# Altium project Heart-by-LED.PrjPCB
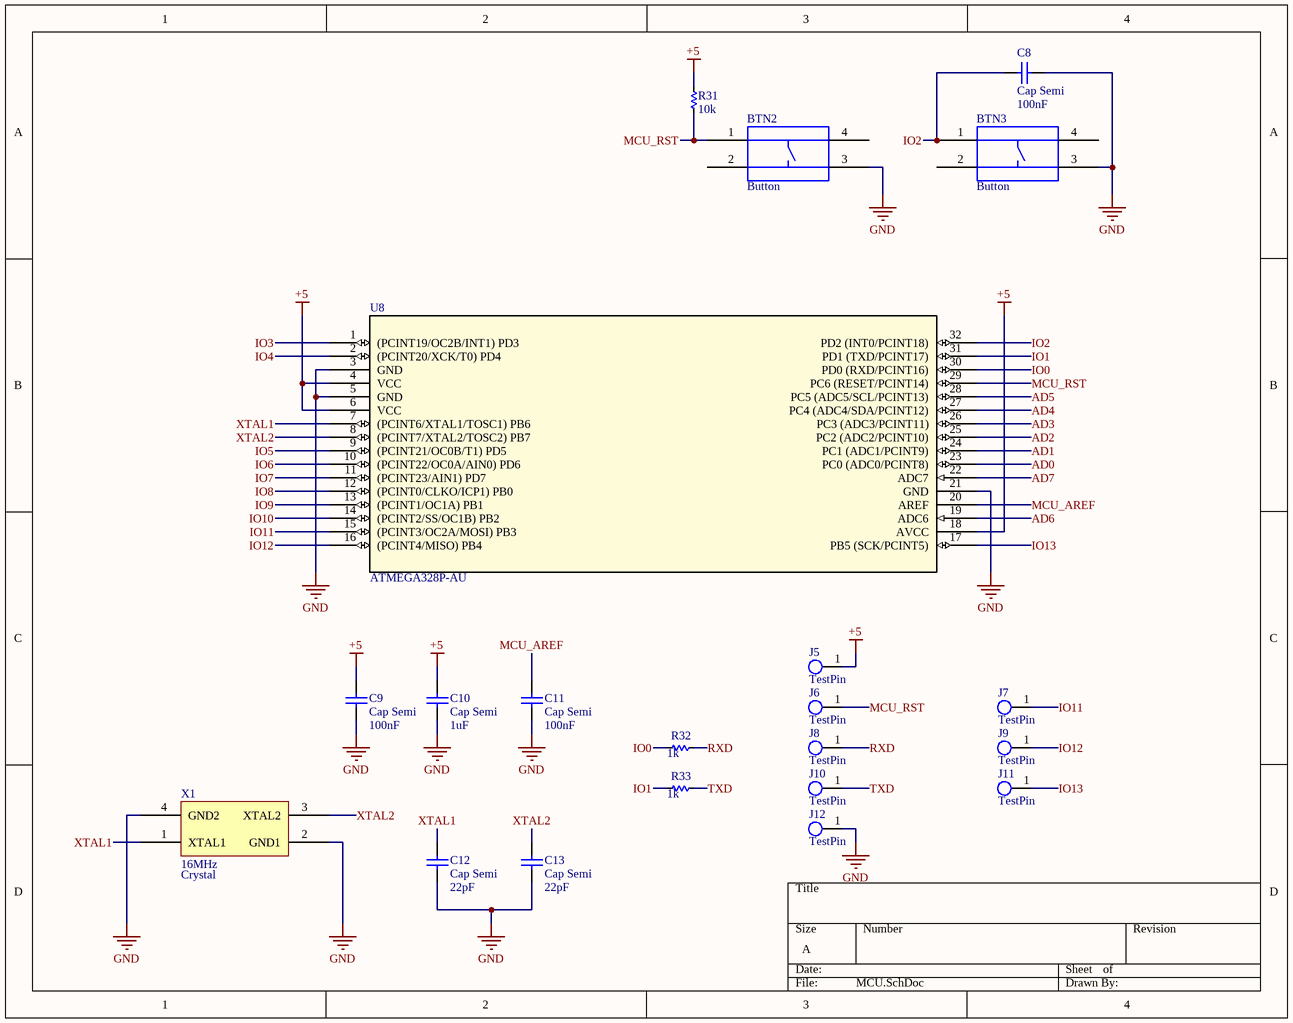
[diagram p0: MCU.SchDoc]
4 sheets, 117 parts. Net scope: global (net labels, ports and power ports of the same name join across sheets).
Board file: Heart-by-LED.PcbDoc
Sheets:
  MCU.SchDoc
  Power.SchDoc
  WS2812B.SchDoc
  LEDs.SchDoc

## Sheet MCU.SchDoc
size A

### Parts
BTN2  Button  [TactileButton_4x4]
BTN3  Button  [TactileButton_4x4]
C8  Cap Semi  value 100nF  [1608[0603]]
C9  Cap Semi  value 100nF  [1608[0603]]
C10  Cap Semi  value 1uF  [1608[0603]]
C11  Cap Semi  value 100nF  [1608[0603]]
C12  Cap Semi  value 22pF  [1608[0603]]
C13  Cap Semi  value 22pF  [1608[0603]]
J5  TestPin  [TestPin_1mm]
J6  TestPin  [TestPin_1mm]
J7  TestPin  [TestPin_1mm]
J8  TestPin  [TestPin_1mm]
J9  TestPin  [TestPin_1mm]
J10  TestPin  [TestPin_1mm]
J11  TestPin  [TestPin_1mm]
J12  TestPin  [TestPin_1mm]
R31  value 10k  [RES-SMD-0603]  (hidden comment: Res)
R32  value 1k  [RES-SMD-0603]  (hidden comment: Res)
R33  value 1k  [RES-SMD-0603]  (hidden comment: Res)
U8  ATMEGA328P-AU  [32A_ATM]
X1  Crystal  [SMD-3225-4P]

### Nets
+5: C9.2 C10.2 J5.1 R31.1 U8.4(VCC) U8.6(VCC) U8.18(AVCC)  [project net LED_DIN_5]
GND: BTN2.3(Pin3) BTN3.3(Pin3) C8.1 C9.1 C10.1 C11.1 C12.1 C13.1 J12.1 U8.3(GND) U8.5(GND) U8.21(GND) X1.2(GND1) X1.4(GND2)
AD0: U8.23(PC0_(ADC0/PCINT8))
AD1: U8.24(PC1_(ADC1/PCINT9))
AD2: U8.25(PC2_(ADC2/PCINT10))
AD3: U8.26(PC3_(ADC3/PCINT11))
AD4: U8.27(PC4_(ADC4/SDA/PCINT12))
AD5: U8.28(PC5_(ADC5/SCL/PCINT13))
AD6: U8.19(ADC6)
AD7: U8.22(ADC7)
IO0: R32.2 U8.30(PD0_(RXD/PCINT16))
IO1: R33.2 U8.31(PD1_(TXD/PCINT17))
IO2: BTN3.1(Pin1) C8.2 U8.32(PD2_(INT0/PCINT18))
IO3: U8.1((PCINT19/OC2B/INT1)_PD3)
IO4: U8.2((PCINT20/XCK/T0)_PD4)
IO5: U8.9((PCINT21/OC0B/T1)_PD5)
IO6: U8.10((PCINT22/OC0A/AIN0)_PD6)
IO7: U8.11((PCINT23/AIN1)_PD7)
IO8: U8.12((PCINT0/CLKO/ICP1)_PB0)
IO9: U8.13((PCINT1/OC1A)_PB1)
IO10: U8.14((PCINT2/SS/OC1B)_PB2)
IO11: J7.1 U8.15((PCINT3/OC2A/MOSI)_PB3)
IO12: J9.1 U8.16((PCINT4/MISO)_PB4)
IO13: J11.1 U8.17(PB5_(SCK/PCINT5))
MCU_AREF: C11.2 U8.20(AREF)
MCU_RST: BTN2.1(Pin1) J6.1 R31.2 U8.29(PC6_(RESET/PCINT14))
RXD: J8.1 R32.1
TXD: J10.1 R33.1
XTAL1: C12.2 U8.7((PCINT6/XTAL1/TOSC1)_PB6) X1.1(XTAL1)
XTAL2: C13.2 U8.8((PCINT7/XTAL2/TOSC2)_PB7) X1.3(XTAL2)

Not connected (* = marked no-connect by the designer): BTN2 2(Pin2) 4(Pin4); BTN3 2(Pin2) 4(Pin4)

### Library data of the parts
BTN2 BTN3 = Tactile_4x4
C8-C13 = Cap Semi: Capacitor (Semiconductor SIM Model); Published: 8-Jun-2000; LatestRevisionDate: 29-May-2009; LatestRevisionNote: IPC-7351 Footprint Added.; PackageReference: C1206; Publisher: Altium Limited; PackageDescription: Chip Capacitor
J5-J12 = TestPin_1mm: Test conntact for pogo pins
R31-R33 = Res-SMD: Resistor; Manufacturer: Generic Components; Class: Passive; Published: 08/06/2000; Publisher: Altium Hobart Technology Centre
U8 = ATMEGA328P-AU: No Description Available; Built_By: EMA_UL_Team; Vendor: Atmel; SourceLibrary: Atmel_2011-04-02; Manufacturer_Part_Number: ATMEGA328P-AU; Copyright: Copyright (C) 2018 Accelerated Designs. All rights reserved; RefDes: RefDes; Type: DEV
X1 = Crystal 3225: 16MHz ±25ppm SMD3225-4P Oscillators ROHS; Value: 16MHz

## Sheet Power.SchDoc
size A
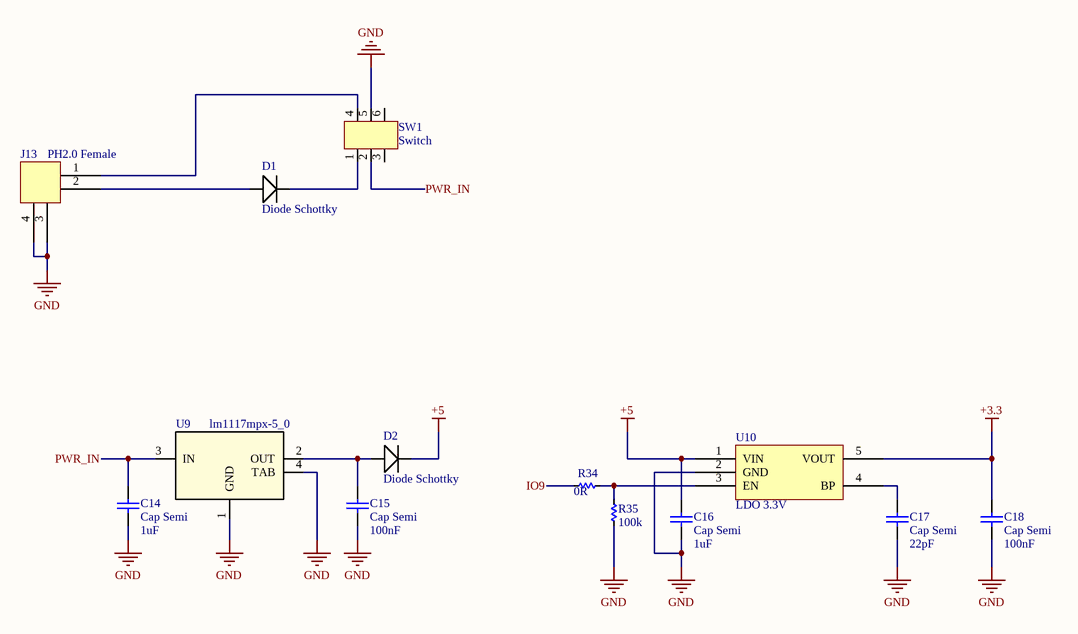
[diagram p1: Power.SchDoc]

### Parts
C14  Cap Semi  value 1uF  [1608[0603]]
C15  Cap Semi  value 100nF  [1608[0603]]
C16  Cap Semi  value 1uF  [1608[0603]]
C17  Cap Semi  value 22pF  [1608[0603]]
C18  Cap Semi  value 100nF  [1608[0603]]
D1  Diode Schottky  [DO-214AC]
D2  Diode Schottky  [DO-214AC]
J13  PH2.0 Female  [PH2.0 FEMALE]
R34  value 0R  [RES-SMD-0603]  (hidden comment: Res)
R35  value 100k  [RES-SMD-0603]  (hidden comment: Res)
SW1  Switch  [MSS-22D18]
U9  lm1117mpx-5_0  [LM1117]
U10  LDO 3.3V  [SOT-23-5]

### Nets
+3.3: C18.2 U10.5(VOUT)
+5: C16.2 D2.1(K) U10.1(VIN)  [project net LED_DIN_5]
GND: C14.1 C15.1 C16.1 C17.1 C18.1 J13.3(Pin_3) J13.4(Pin_4) R35.2 SW1.5(Pin_5) U9.1(GND) U9.4(TAB) U10.2(GND)
IO9: R34.2
PWR_IN: C14.2 SW1.2(Pin_2) U9.3(IN)
NetC15_2: C15.2 D2.2(A) U9.2(OUT)
NetC17_2: C17.2 U10.4(BP)
NetD1_1: D1.1(K) SW1.1(Pin_1)
NetD1_2: D1.2(A) J13.2(Pin_2)
NetJ13_1: J13.1(Pin_1) SW1.4(Pin_4)
NetR34_1: R34.1 R35.1 U10.3(EN)

Not connected (* = marked no-connect by the designer): SW1 3(Pin_3) 6(Pin_6)

### Library data of the parts
C14-C18 = Cap Semi: Capacitor (Semiconductor SIM Model); Published: 8-Jun-2000; LatestRevisionDate: 29-May-2009; LatestRevisionNote: IPC-7351 Footprint Added.; PackageReference: C1206; Publisher: Altium Limited; PackageDescription: Chip Capacitor
D1 D2 = SS54 SMA: Diode Shotky SS54 5A 40V; Value: SS54 SMA
J13 = PH2.0: 2 Header PH 0.079"(2.00mm) Male Pin SMD,P=2mm Wire To Board / Wire To Wire Connector ROHS
R34 R35 = Res-SMD: as R31 on sheet MCU; Published: 08/06/2000; Publisher: Altium Hobart Technology Centre
SW1 = MSS-22D18: Plugin,9.1x3.5mm Slide Switches ROHS
U9 = lm1117mpx-5_0: No Description Available; Vendor: Texas Instruments; Built_By: EMA_UL_Team; Manufacturer_Part_Number: lm1117mpx-5_0; Copyright: Copyright (C) 2018 Accelerated Designs. All rights reserved; RefDes: RefDes; Type: DEV; Value: Value
U10 = RT9193-33GB: 300mA Fixed 3.3V SOT-23-5 Linear Voltage Regulators (LDO) ROHS

## Sheet WS2812B.SchDoc
size A
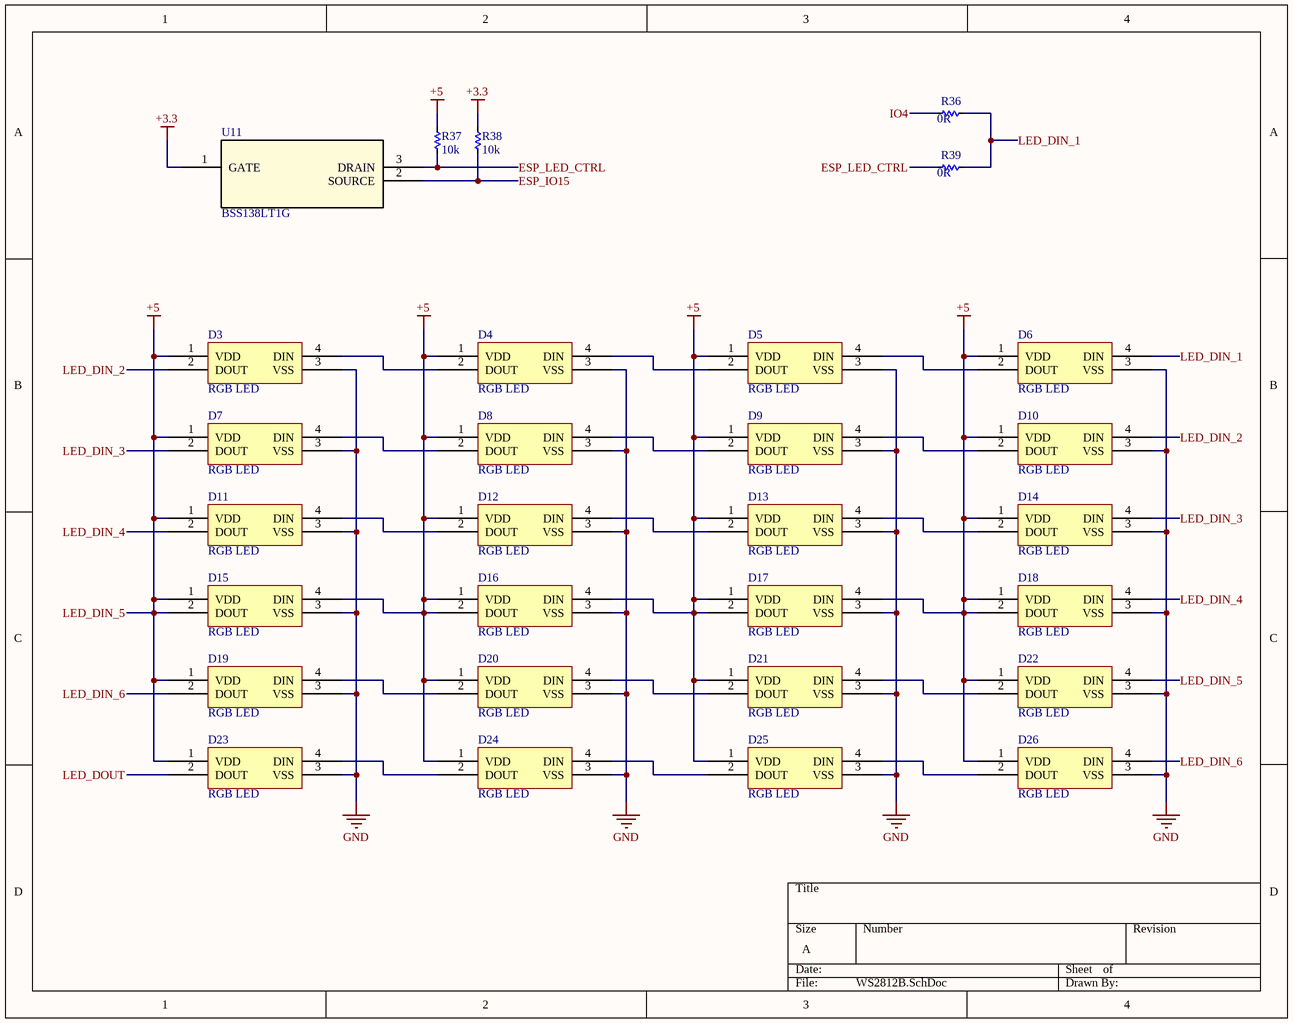
[diagram p2: WS2812B.SchDoc]

### Parts
D3  RGB LED  [WS2812B]
D4  RGB LED  [WS2812B]
D5  RGB LED  [WS2812B]
D6  RGB LED  [WS2812B]
D7  RGB LED  [WS2812B]
D8  RGB LED  [WS2812B]
D9  RGB LED  [WS2812B]
D10  RGB LED  [WS2812B]
D11  RGB LED  [WS2812B]
D12  RGB LED  [WS2812B]
D13  RGB LED  [WS2812B]
D14  RGB LED  [WS2812B]
D15  RGB LED  [WS2812B]
D16  RGB LED  [WS2812B]
D17  RGB LED  [WS2812B]
D18  RGB LED  [WS2812B]
D19  RGB LED  [WS2812B]
D20  RGB LED  [WS2812B]
D21  RGB LED  [WS2812B]
D22  RGB LED  [WS2812B]
D23  RGB LED  [WS2812B]
D24  RGB LED  [WS2812B]
D25  RGB LED  [WS2812B]
D26  RGB LED  [WS2812B]
R36  value 0R  [RES-SMD-0603]  (hidden comment: Res)
R37  value 10k  [RES-SMD-0603]  (hidden comment: Res)
R38  value 10k  [RES-SMD-0603]  (hidden comment: Res)
R39  value 0R  [RES-SMD-0603]  (hidden comment: Res)
U11  BSS138LT1G  [SOT23-3_ONS]

### Nets
+3.3: R38.1 U11.1(GATE)
GND: D3.3(VSS) D4.3(VSS) D5.3(VSS) D6.3(VSS) D7.3(VSS) D8.3(VSS) D9.3(VSS) D10.3(VSS) D11.3(VSS) D12.3(VSS) D13.3(VSS) D14.3(VSS) D15.3(VSS) D16.3(VSS) D17.3(VSS) D18.3(VSS) D19.3(VSS) D20.3(VSS) D21.3(VSS) D22.3(VSS) D23.3(VSS) D24.3(VSS) D25.3(VSS) D26.3(VSS)
LED_DIN_5: D3.1(VDD) D4.1(VDD) D5.1(VDD) D6.1(VDD) D7.1(VDD) D8.1(VDD) D9.1(VDD) D10.1(VDD) D11.1(VDD) D12.1(VDD) D13.1(VDD) D14.1(VDD) D15.1(VDD) D15.2(DOUT) D15.4(DIN) D16.1(VDD) D16.2(DOUT) D16.4(DIN) D17.1(VDD) D17.2(DOUT) D17.4(DIN) D18.1(VDD) D18.2(DOUT) D19.1(VDD) D20.1(VDD) D21.1(VDD) D22.1(VDD) D22.4(DIN) D23.1(VDD) D24.1(VDD) D25.1(VDD) D26.1(VDD) R37.1  [also labelled +5]
ESP_IO15: R38.2 U11.2(SOURCE)
ESP_LED_CTRL: R37.2 R39.2 U11.3(DRAIN)
IO4: R36.2
LED_DIN_1: D6.4(DIN) R36.1 R39.1
LED_DIN_2: D3.2(DOUT) D10.4(DIN)
LED_DIN_3: D7.2(DOUT) D14.4(DIN)
LED_DIN_4: D11.2(DOUT) D18.4(DIN)
LED_DIN_6: D19.2(DOUT) D26.4(DIN)
LED_DOUT: D23.2(DOUT)
NetD3_4: D3.4(DIN) D4.2(DOUT)
NetD4_4: D4.4(DIN) D5.2(DOUT)
NetD5_4: D5.4(DIN) D6.2(DOUT)
NetD7_4: D7.4(DIN) D8.2(DOUT)
NetD8_4: D8.4(DIN) D9.2(DOUT)
NetD9_4: D9.4(DIN) D10.2(DOUT)
NetD11_4: D11.4(DIN) D12.2(DOUT)
NetD12_4: D12.4(DIN) D13.2(DOUT)
NetD13_4: D13.4(DIN) D14.2(DOUT)
NetD19_4: D19.4(DIN) D20.2(DOUT)
NetD20_4: D20.4(DIN) D21.2(DOUT)
NetD21_4: D21.4(DIN) D22.2(DOUT)
NetD23_4: D23.4(DIN) D24.2(DOUT)
NetD24_4: D24.4(DIN) D25.2(DOUT)
NetD25_4: D25.4(DIN) D26.2(DOUT)

### Library data of the parts
D3-D26 = WS2812B: RGB 620~630nm Red, 515~530nm Green, 465~475nm Blue SMD,5x5mm Light Emitting Diodes (LED) ROHS; Manufacturer: Worldsemi; Value: WS2812B
R36-R39 = Res-SMD: as R31 on sheet MCU; Published: 08/06/2000; Publisher: Altium Hobart Technology Centre
U11 = BSS138LT1G: No Description Available; Vendor: ON Semiconductor; Built_By: EMA_Jessica; SourceLibrary: ON_Semiconductor_2019-12-30; Manufacturer_Part_Number: BSS138LT1G; Copyright: Copyright (C) 2018 Accelerated Designs. All rights reserved; RefDes: RefDes; Type: DEV

## Sheet LEDs.SchDoc
size A
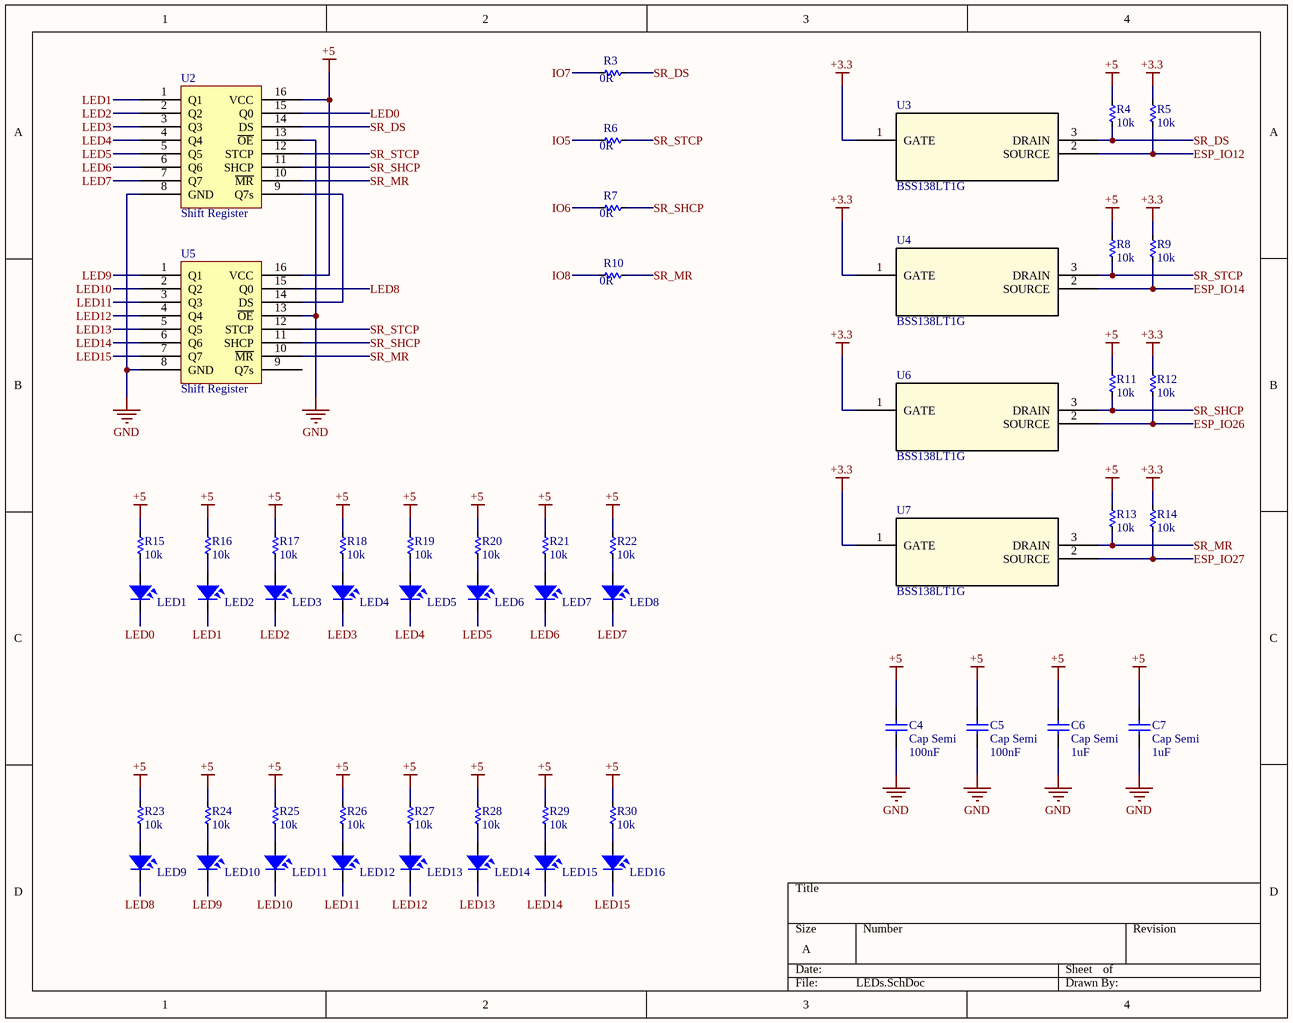
[diagram p3: LEDs.SchDoc]

### Parts
C4  Cap Semi  value 100nF  [1608[0603]]
C5  Cap Semi  value 100nF  [1608[0603]]
C6  Cap Semi  value 1uF  [1608[0603]]
C7  Cap Semi  value 1uF  [1608[0603]]
LED1  LED  [LED-0805-Red]  (value not drawn)
LED2  LED  [LED-0805-Red]  (value not drawn)
LED3  LED  [LED-0805-Red]  (value not drawn)
LED4  LED  [LED-0805-Red]  (value not drawn)
LED5  LED  [LED-0805-Red]  (value not drawn)
LED6  LED  [LED-0805-Red]  (value not drawn)
LED7  LED  [LED-0805-Red]  (value not drawn)
LED8  LED  [LED-0805-Red]  (value not drawn)
LED9  LED  [LED-0805-Red]  (value not drawn)
LED10  LED  [LED-0805-Red]  (value not drawn)
LED11  LED  [LED-0805-Red]  (value not drawn)
LED12  LED  [LED-0805-Red]  (value not drawn)
LED13  LED  [LED-0805-Red]  (value not drawn)
LED14  LED  [LED-0805-Red]  (value not drawn)
LED15  LED  [LED-0805-Red]  (value not drawn)
LED16  LED  [LED-0805-Red]  (value not drawn)
R3  value 0R  [RES-SMD-0603]  (hidden comment: Res)
R4  value 10k  [RES-SMD-0603]  (hidden comment: Res)
R5  value 10k  [RES-SMD-0603]  (hidden comment: Res)
R6  value 0R  [RES-SMD-0603]  (hidden comment: Res)
R7  value 0R  [RES-SMD-0603]  (hidden comment: Res)
R8  value 10k  [RES-SMD-0603]  (hidden comment: Res)
R9  value 10k  [RES-SMD-0603]  (hidden comment: Res)
R10  value 0R  [RES-SMD-0603]  (hidden comment: Res)
R11  value 10k  [RES-SMD-0603]  (hidden comment: Res)
R12  value 10k  [RES-SMD-0603]  (hidden comment: Res)
R13  value 10k  [RES-SMD-0603]  (hidden comment: Res)
R14  value 10k  [RES-SMD-0603]  (hidden comment: Res)
R15  value 10k  [RES-SMD-0603]  (hidden comment: Res)
R16  value 10k  [RES-SMD-0603]  (hidden comment: Res)
R17  value 10k  [RES-SMD-0603]  (hidden comment: Res)
R18  value 10k  [RES-SMD-0603]  (hidden comment: Res)
R19  value 10k  [RES-SMD-0603]  (hidden comment: Res)
R20  value 10k  [RES-SMD-0603]  (hidden comment: Res)
R21  value 10k  [RES-SMD-0603]  (hidden comment: Res)
R22  value 10k  [RES-SMD-0603]  (hidden comment: Res)
R23  value 10k  [RES-SMD-0603]  (hidden comment: Res)
R24  value 10k  [RES-SMD-0603]  (hidden comment: Res)
R25  value 10k  [RES-SMD-0603]  (hidden comment: Res)
R26  value 10k  [RES-SMD-0603]  (hidden comment: Res)
R27  value 10k  [RES-SMD-0603]  (hidden comment: Res)
R28  value 10k  [RES-SMD-0603]  (hidden comment: Res)
R29  value 10k  [RES-SMD-0603]  (hidden comment: Res)
R30  value 10k  [RES-SMD-0603]  (hidden comment: Res)
U2  Shift Register  [SO16]
U3  BSS138LT1G  [SOT23-3_ONS]
U4  BSS138LT1G  [SOT23-3_ONS]
U5  Shift Register  [SO16]
U6  BSS138LT1G  [SOT23-3_ONS]
U7  BSS138LT1G  [SOT23-3_ONS]

### Nets
+3.3: R5.1 R9.1 R12.1 R14.1 U3.1(GATE) U4.1(GATE) U6.1(GATE) U7.1(GATE)
+5: C4.1 C5.1 C6.1 C7.1 R4.1 R8.1 R11.1 R13.1 R15.1 R16.1 R17.1 R18.1 R19.1 R20.1 R21.1 R22.1 R23.1 R24.1 R25.1 R26.1 R27.1 R28.1 R29.1 R30.1 U2.16(VCC) U5.16(VCC)  [project net LED_DIN_5]
GND: C4.2 C5.2 C6.2 C7.2 U2.8(GND) U2.13(~{OE}) U5.8(GND) U5.13(~{OE})
ESP_IO12: R5.2 U3.2(SOURCE)
ESP_IO14: R9.2 U4.2(SOURCE)
ESP_IO26: R12.2 U6.2(SOURCE)
ESP_IO27: R14.2 U7.2(SOURCE)
IO5: R6.2
IO6: R7.2
IO7: R3.2
IO8: R10.2
LED0: LED1.2 U2.15(Q0)
LED1: LED2.2 U2.1(Q1)
LED2: LED3.2 U2.2(Q2)
LED3: LED4.2 U2.3(Q3)
LED4: LED5.2 U2.4(Q4)
LED5: LED6.2 U2.5(Q5)
LED6: LED7.2 U2.6(Q6)
LED7: LED8.2 U2.7(Q7)
LED8: LED9.2 U5.15(Q0)
LED9: LED10.2 U5.1(Q1)
LED10: LED11.2 U5.2(Q2)
LED11: LED12.2 U5.3(Q3)
LED12: LED13.2 U5.4(Q4)
LED13: LED14.2 U5.5(Q5)
LED14: LED15.2 U5.6(Q6)
LED15: LED16.2 U5.7(Q7)
SR_DS: R3.1 R4.2 U2.14(DS) U3.3(DRAIN)
SR_MR: R10.1 R13.2 U2.10(~{MR}) U5.10(~{MR}) U7.3(DRAIN)
SR_SHCP: R7.1 R11.2 U2.11(SHCP) U5.11(SHCP) U6.3(DRAIN)
SR_STCP: R6.1 R8.2 U2.12(STCP) U4.3(DRAIN) U5.12(STCP)
NetLED1_1: LED1.1 R15.2
NetLED2_1: LED2.1 R16.2
NetLED3_1: LED3.1 R17.2
NetLED4_1: LED4.1 R18.2
NetLED5_1: LED5.1 R19.2
NetLED6_1: LED6.1 R20.2
NetLED7_1: LED7.1 R21.2
NetLED8_1: LED8.1 R22.2
NetLED9_1: LED9.1 R23.2
NetLED10_1: LED10.1 R24.2
NetLED11_1: LED11.1 R25.2
NetLED12_1: LED12.1 R26.2
NetLED13_1: LED13.1 R27.2
NetLED14_1: LED14.1 R28.2
NetLED15_1: LED15.1 R29.2
NetLED16_1: LED16.1 R30.2
NetU2_9: U2.9(Q7s) U5.14(DS)

Not connected (* = marked no-connect by the designer): U5 9(Q7s)

### Library data of the parts
C4-C7 = Cap Semi: Capacitor (Semiconductor SIM Model); Published: 8-Jun-2000; LatestRevisionDate: 29-May-2009; LatestRevisionNote: IPC-7351 Footprint Added.; PackageReference: C1206; Publisher: Altium Limited; PackageDescription: Chip Capacitor
LED1-LED16 = LED SMD: Value: LED 3 - 5 ly 2 Colour
R3-R30 = Res-SMD: as R31 on sheet MCU; Published: 08/06/2000; Publisher: Altium Hobart Technology Centre
U2 U5 = 74HC595: 74HC Shift Register SOIC-16_150mil Registers ROHS; Value: 74HC595D
U3 U4 U6 U7 = BSS138LT1G: as U11 on sheet WS2812B; Manufacturer_Part_Number: BSS138LT1G; Copyright: Copyright (C) 2018 Accelerated Designs. All rights reserved; RefDes: RefDes; Type: DEV

## Nets that join several sheets
+3.3: Power (C18.2 U10.5), WS2812B (R38.1 U11.1), LEDs (8 pins)
GND: MCU (14 pins), Power (12 pins), WS2812B (24 pins), LEDs (8 pins)
LED_DIN_5: MCU (7 pins), Power (C16.2 D2.1 U10.1), WS2812B (33 pins), LEDs (26 pins)
IO4: MCU (U8.2), WS2812B (R36.2)
IO5: MCU (U8.9), LEDs (R6.2)
IO6: MCU (U8.10), LEDs (R7.2)
IO7: MCU (U8.11), LEDs (R3.2)
IO8: MCU (U8.12), LEDs (R10.2)
IO9: MCU (U8.13), Power (R34.2)